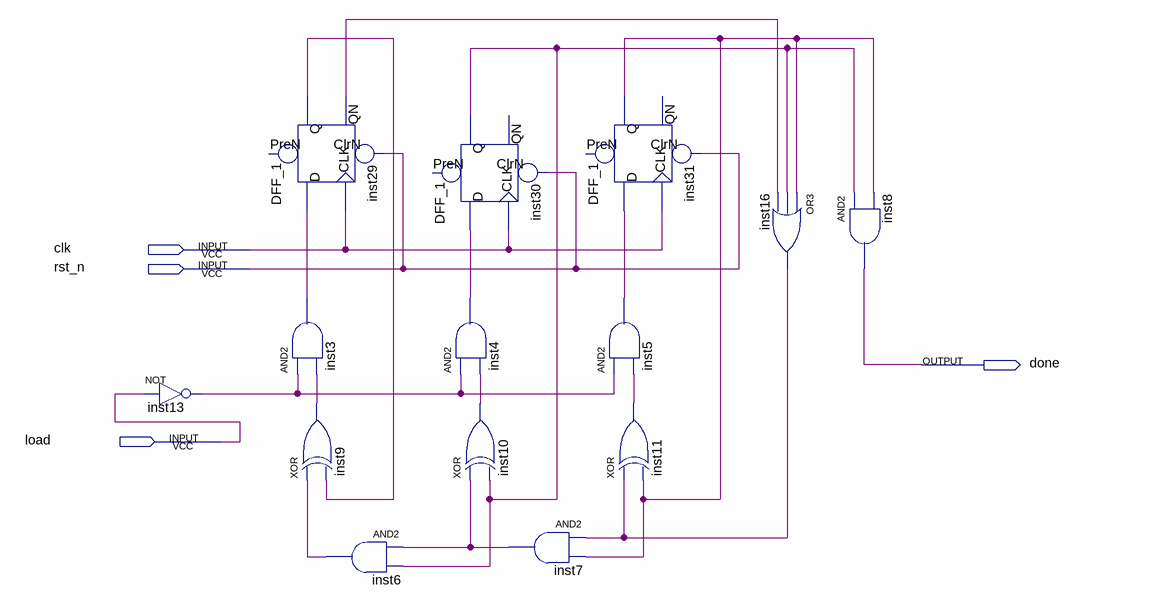
[diagram p0: schematic sheet]
// Quartus schematic controller.bdf as structural Verilog: 14 symbols, 4 pins
module controller (
  input  clk,
  input  rst_n,
  input  load,
  output done
);

  wire inst3_out, inst4_out, inst5_out, inst6_out, inst7_out, inst9_out, inst10_out, inst11_out, inst13_out,
       inst16_out, inst29_q, inst29_qn, inst30_q, inst31_q;

  not inst13 (inst13_out, load);
  DFF_1 inst29 (.CLK(clk), .D(inst3_out), .ClrN(rst_n), .QN(inst29_qn), .Q(inst29_q));  // open: PreN
  and inst3 (inst3_out, inst13_out, inst9_out);
  xor inst9 (inst9_out, inst6_out, inst29_q);
  and inst6 (inst6_out, inst7_out, inst30_q);
  DFF_1 inst30 (.CLK(clk), .D(inst4_out), .ClrN(rst_n), .Q(inst30_q));  // open: PreN, QN
  and inst4 (inst4_out, inst13_out, inst10_out);
  xor inst10 (inst10_out, inst7_out, inst30_q);
  and inst7 (inst7_out, inst16_out, inst31_q);
  DFF_1 inst31 (.CLK(clk), .D(inst5_out), .ClrN(rst_n), .Q(inst31_q));  // open: PreN, QN
  and inst5 (inst5_out, inst13_out, inst11_out);
  xor inst11 (inst11_out, inst16_out, inst31_q);
  or inst16 (inst16_out, inst31_q, inst30_q, inst29_qn);
  and inst8 (done, inst30_q, inst31_q);
endmodule
